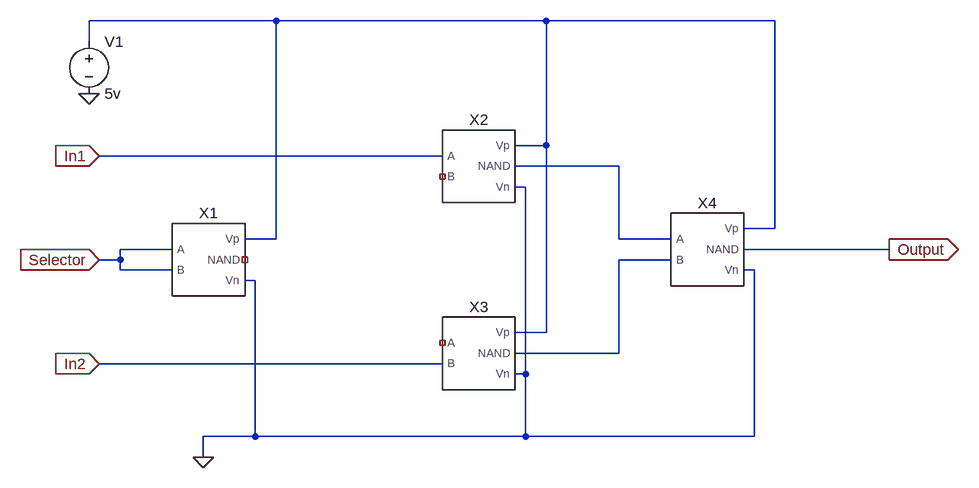
[diagram p0: schematic 2_1_Multiplexer.asc]
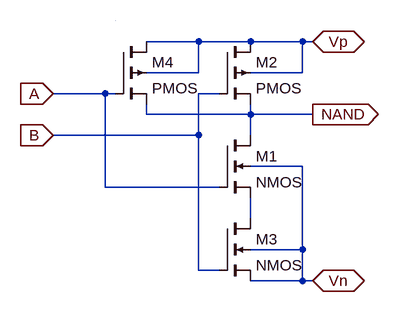
[diagram p1: sub-circuit cmos-nand.asc]
2_1_Multiplexer.asc, the LTspice schematic file:
Version 4
SHEET 1 1292 680
WIRE 208 -208 -80 -208
WIRE 624 -208 208 -208
WIRE 976 -208 624 -208
WIRE -80 -176 -80 -208
WIRE 624 -16 624 -208
WIRE 624 -16 576 -16
WIRE 464 0 -64 0
WIRE 736 16 576 16
WIRE 592 48 576 48
WIRE 976 112 976 -208
WIRE 976 112 928 112
WIRE 208 128 208 -208
WIRE 208 128 160 128
WIRE 736 128 736 16
WIRE 816 128 736 128
WIRE 48 144 -32 144
WIRE 1152 144 928 144
WIRE -32 160 -32 144
WIRE -32 160 -64 160
WIRE 816 160 736 160
WIRE -32 176 -32 160
WIRE 48 176 -32 176
WIRE 944 176 928 176
WIRE 176 192 160 192
WIRE 624 272 624 -16
WIRE 624 272 576 272
WIRE 736 304 736 160
WIRE 736 304 576 304
WIRE 464 320 -64 320
WIRE 592 336 592 48
WIRE 592 336 576 336
WIRE 176 432 176 192
WIRE 176 432 96 432
WIRE 592 432 592 336
WIRE 592 432 176 432
WIRE 944 432 944 176
WIRE 944 432 592 432
WIRE 96 464 96 432
FLAG -64 0 In1
IOPIN -64 0 In
FLAG -64 320 In2
IOPIN -64 320 In
FLAG -64 160 Selector
IOPIN -64 160 In
FLAG 1152 144 Output
IOPIN 1152 144 Out
FLAG 96 464 0
FLAG -80 -96 0
SYMBOL cmos-nand 96 160 R0
SYMATTR InstName X1
SYMBOL cmos-nand 512 16 R0
SYMATTR InstName X2
SYMBOL cmos-nand 512 304 R0
SYMATTR InstName X3
SYMBOL cmos-nand 864 144 R0
SYMATTR InstName X4
SYMBOL voltage -80 -192 R0
WINDOW 123 0 0 Left 0
WINDOW 39 0 0 Left 0
SYMATTR InstName V1
SYMATTR Value 5v

cmos-nand.asc, the sub-circuit schematic file:
Version 4
SHEET 1 880 680
WIRE 128 32 48 32
WIRE 208 32 128 32
WIRE 288 32 208 32
WIRE 304 32 288 32
WIRE 128 80 128 32
WIRE 128 80 48 80
WIRE 288 80 288 32
WIRE 288 80 208 80
WIRE -16 112 -96 112
WIRE 0 112 -16 112
WIRE 160 112 128 112
WIRE 48 144 48 128
WIRE 208 144 208 128
WIRE 208 144 48 144
WIRE 304 144 208 144
WIRE 128 176 128 112
WIRE 128 176 -96 176
WIRE 208 176 208 144
WIRE 288 224 208 224
WIRE -16 256 -16 112
WIRE 160 256 -16 256
WIRE 208 304 208 272
WIRE 288 352 288 224
WIRE 288 352 208 352
WIRE 128 384 128 176
WIRE 160 384 128 384
WIRE 288 400 288 352
WIRE 288 400 208 400
WIRE 304 400 288 400
WIRE 0 0 0 0
FLAG 304 32 Vp
IOPIN 304 32 BiDir
FLAG 304 400 Vn
IOPIN 304 400 BiDir
FLAG 304 144 NAND
IOPIN 304 144 Out
FLAG -96 112 A
IOPIN -96 112 In
FLAG -96 176 B
IOPIN -96 176 In
SYMBOL nmos4 160 176 R0
SYMATTR InstName M1
SYMBOL pmos4 160 32 R0
SYMATTR InstName M2
SYMBOL nmos4 160 304 R0
SYMATTR InstName M3
SYMBOL pmos4 0 32 R0
SYMATTR InstName M4

The netlist it stands for:
* 2_1_Multiplexer.asc
XX1 Selector Selector NC_01 0 N001 cmos-nand
XX2 In1 NC_02 N002 0 N001 cmos-nand
XX3 NC_03 In2 N003 0 N001 cmos-nand
XX4 N002 N003 Output 0 N001 cmos-nand
V1 N001 0 5v

* block symbol definitions
.subckt cmos-nand A B NAND Vn Vp
M1 NAND A N001 Vn NMOS
M2 Vp B NAND Vp PMOS
M3 N001 B Vn Vn NMOS
M4 Vp A NAND Vp PMOS
.ends cmos-nand

.model NMOS NMOS
.model PMOS PMOS
.lib standard.mos
.backanno
.end